# EAGLE schematic Light-Proximity-Switch-vB2.1 (EAGLE 9.5.2)
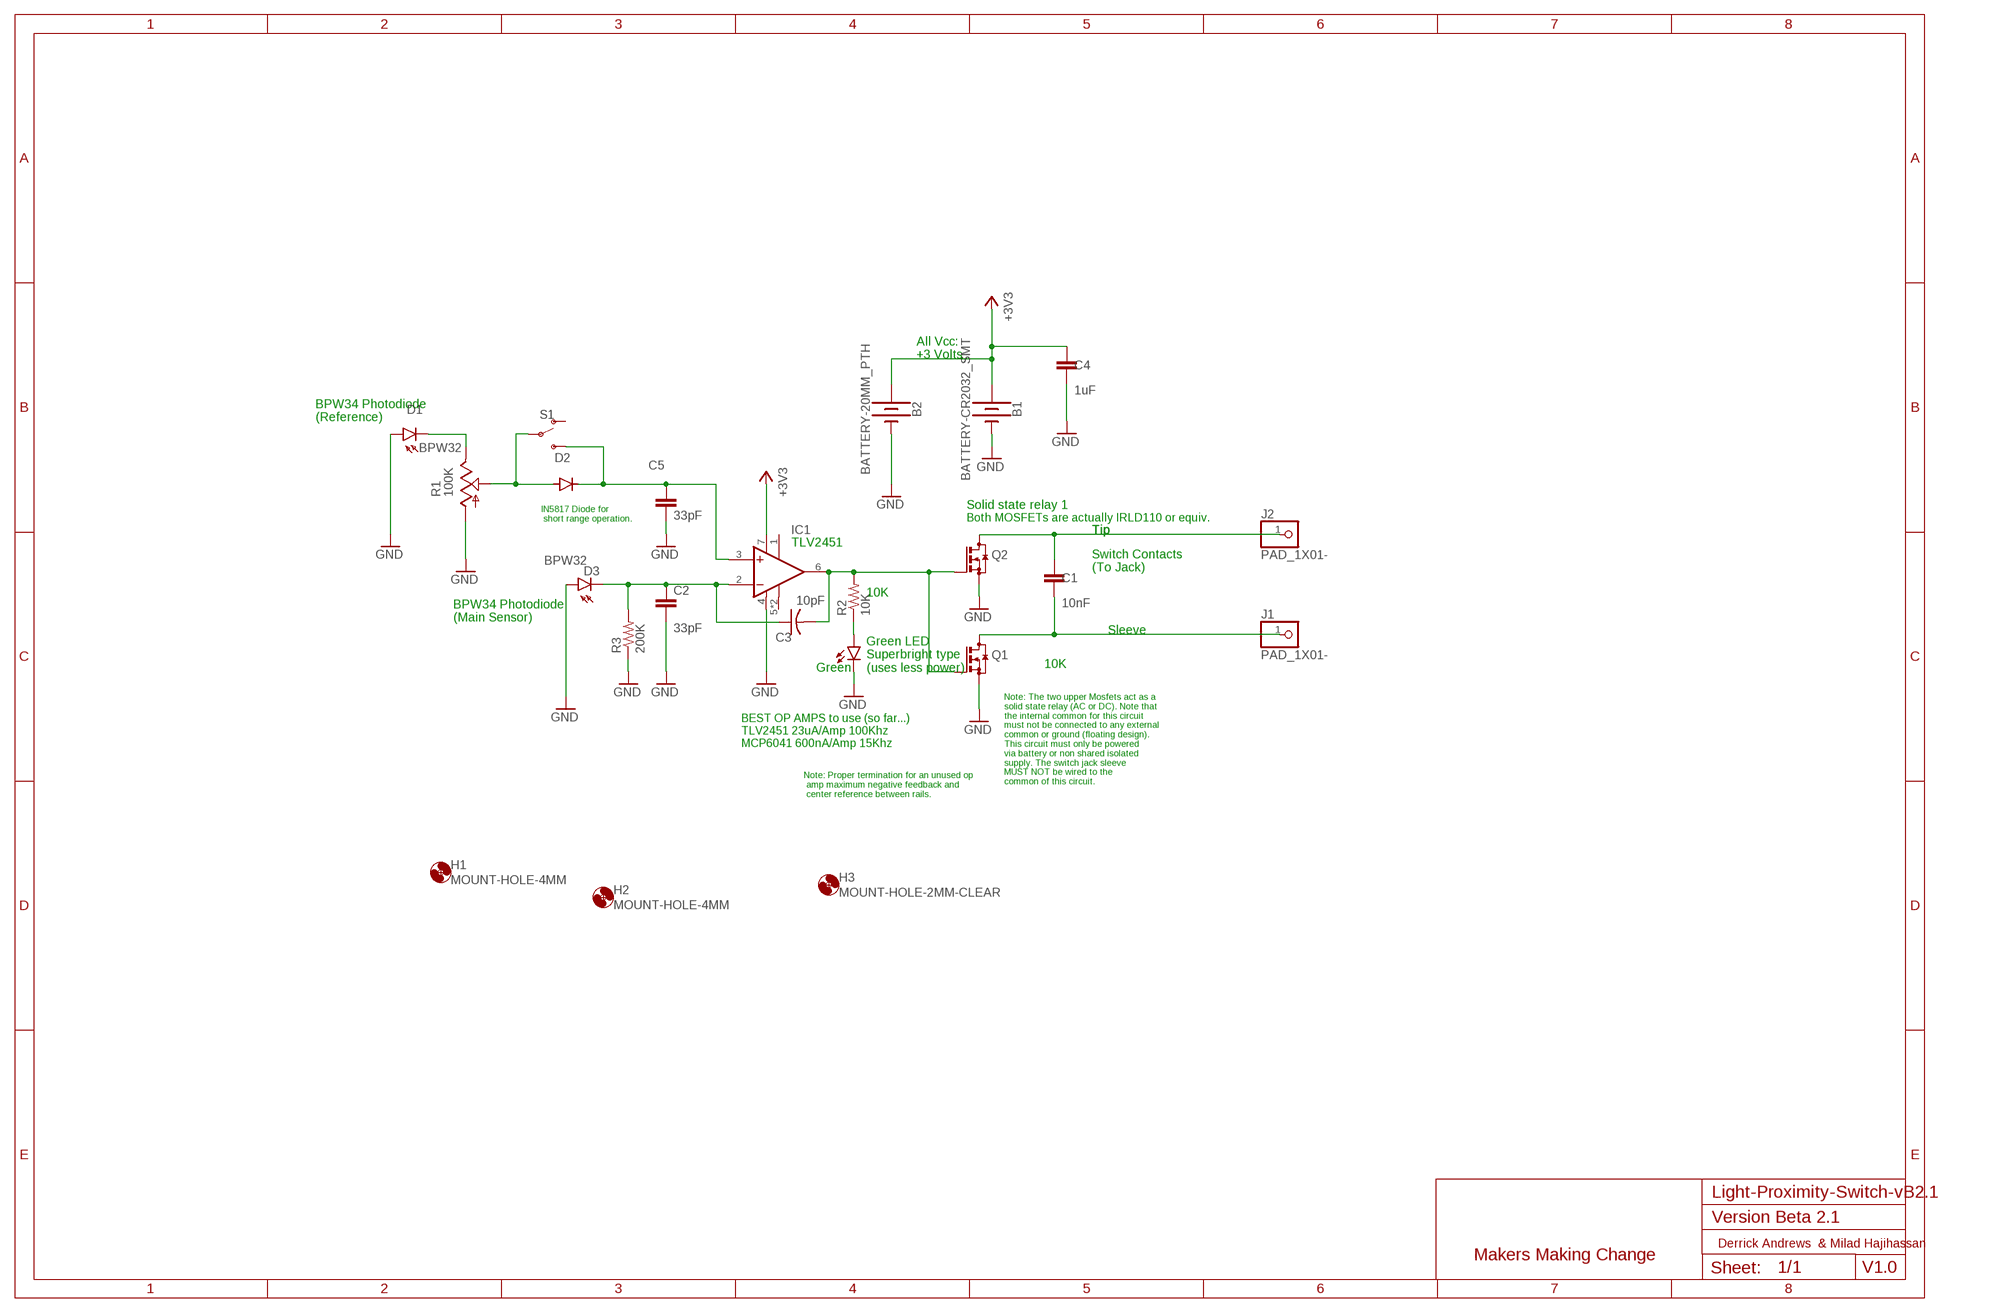
[diagram p0: schematic, sheet 1]

## Parts
B1  BATTERY-CR2032_SMT  [CR2032_SMT_HOLDER]
B2  BATTERY-20MM_PTH  [BATTCOM_20MM_PTH]
C1  10nF  CAPACITOR-EU-  [CAP-PTH-SMALL-KIT]
C2  33pF  CAPACITOR-EU-  [CAP-PTH-SMALL-KIT]
C3  10pF  CAPACITOR-US-025  [C025-030X050]
C4  1uF  CAPACITOR-EU-  [CAP-PTH-SMALL-KIT]
C5  33pF  CAPACITOR-EU-  [CAP-PTH-SMALL-KIT]
D1  BPW32  [BPW32]
D2  DIODE-DO41  [DO41-10]
D3  BPW32  [BPW32]
H1  MOUNT-HOLE-4MM  [HOLE-4MM]
H2  MOUNT-HOLE-4MM  [HOLE-4MM]
H3  MOUNT-HOLE-2MM-CLEAR  [HOLE-2MM-CLEAR]
IC1  TLV2451  [DIL08]
J1  PAD_1X01-  [PAD-1X01]
J2  PAD_1X01-  [PAD-1X01]
LED1  LED_5MM-5MM-GREEN  [LED_5MM_GREEN]
Q1  IRLD110-HVM-DIP  [HVM-DIP]
Q2  IRLD110-HVM-DIP  [HVM-DIP]
R1  100K  TRIM-3386P-T  [3386P-T]
R2  10K  RESISTOR-US-0206/8  [RESISTOR_0206/8]
R3  200K  RESISTOR-US-0206/8  [RESISTOR_0206/8]
S1  SWITCH-SPDT-PTH_11.6X4.0MM  [SWITCH_SPDT_PTH_11.6X4.0MM]

## Nets
+3V3: B1.+ B2.+ C4.1 IC1.7(V+)
GND: B1.- B2.- C2.2 C4.2 C5.2 D1.A D3.A IC1.4(V-) LED1.K(C) Q1.2(S) Q2.2(S) R1.A R3.1
N$1: D2.A R1.S S1.2(P)
N$2: C5.1 D2.C IC1.3(+IN) S1.3(S)
N$3: D1.K(C) R1.E
N$4: C3.2 IC1.6(OUT) Q1.1(G) Q2.1(G) R2.2
N$6: C1.2 J1.1 Q1.3(D)
N$7: C1.1 J2.1 Q2.3(D)
N$9: C2.1 C3.1 D3.K(C) IC1.2(-IN) R3.2
N$15: LED1.A R2.1
Unconnected: IC1.1(VT1) IC1.5(VT2) IC1.8(VT2) S1.1(O)

## Notes on the sheet
- All Vcc:
  +3 Volts
- BPW34 Photodiode
  (Reference)
- Solid state relay 1
- IN5817 Diode for
   short range operation.
- Both MOSFETs are actually IRLD110 or equiv.
- Tip | Tip
- TLV2451
- Switch Contacts
  (To Jack)
- 10K
- BPW34 Photodiode
  (Main Sensor)
- Sleeve
- 10K
- Green
- Green LED
  Superbright type
  (uses less power)
- BEST OP AMPS to use (so far...)
  TLV2451 23uA/Amp 100Khz
  MCP6041 600nA/Amp 15Khz
- Note: The two upper Mosfets act as a
  solid state relay (AC or DC). Note that
  the internal common for this circuit
  must not be connected to any external
  common or ground (floating design).
  This circuit must only be powered
  via battery or non shared isolated
  supply. The switch jack sleeve 
  MUST NOT be wired to the
  common of this circuit.
- Note: Proper termination for an unused op
   amp maximum negative feedback and
   center reference between rails.
- Version Beta 2.1
- Derrick Andrews  & Milad Hajihassan
- Makers Making Change
- V1.0

## Library data of the parts
B1 B2 = MMC Eagle:BATTERY-: BATTERY HOLDER COIN 20MM SMD - Manufacturer Product Number: BU2032SM-BT-GTR
C1 C2 C4 C5 = MMC Eagle:CAPACITOR-EU-
C3 = MMC Eagle:CAPACITOR-US-
D1 D3 = MMC Eagle:BPW32: PHOTO DIODE
D2 = MMC Eagle:DIODE-: DIODE 1.0 A, 200 V, 150 ns
H1-H3 = MMC Eagle:MOUNT-HOLE-: MOUNTING HOLE with drill center marker
IC1 = MMC Eagle:TLV2451
J1 J2 = MMC Eagle:PAD_1X01-
LED1 = MMC Eagle:LED_5MM-: LED (Generic) Standard schematic elements and footprints for 5mm, 3mm, 1206, and 0603 sized LEDs. Generic LEDs with no color specified.
Q1 Q2 = MMC Eagle:IRLD110
R1 = MMC Eagle:TRIM-: POTENTIOMETER
R2 R3 = MMC Eagle:RESISTOR-US-: RESISTOR, American symbol
S1 = MMC Eagle:SWITCH-SPDT-

## Net classes
2 GND2: clearance 0.205 mm to class 0, clearance 0.205 mm to class 1, clearance 0.205 mm
3 GND3: clearance 0.205 mm to class 0, clearance 0.205 mm to class 1, clearance 0.205 mm to class 2, clearance 0.205 mm